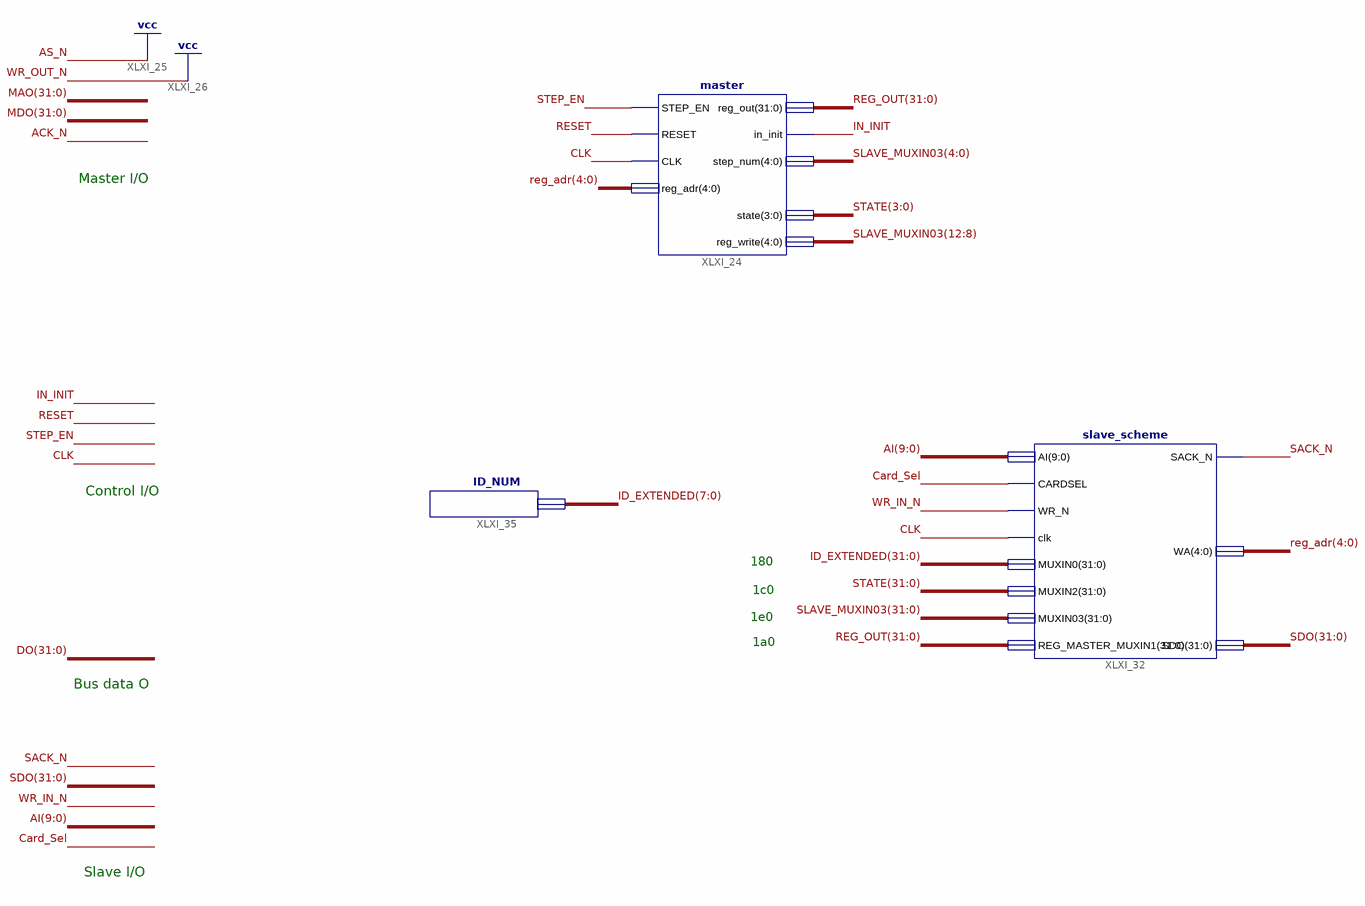
[diagram p0: schematic sheet 1]
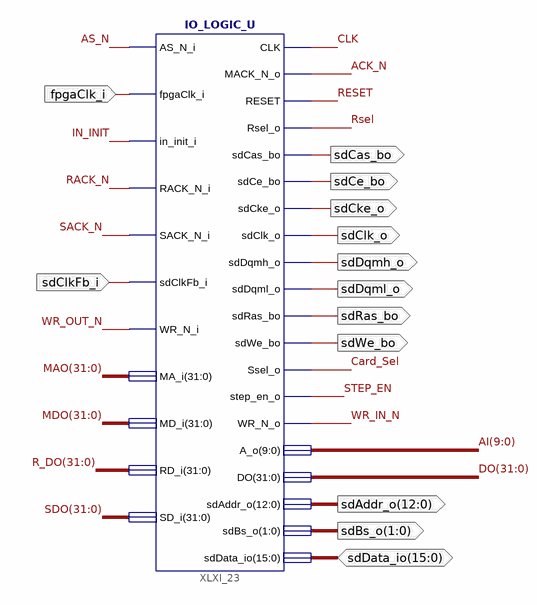
[diagram p1: schematic sheet 2]
// Xilinx ISE schematic Top_Level.sch (spartan6) as structural Verilog: 4 symbols, 13 ports
module Top_Level (
  input  fpgaClk_i,
  input  sdClkFb_i,
  inout  [15:0] sdData_io,
  output sdClk_o,
  output [1:0] sdBs_o,
  output sdDqml_o,
  output sdDqmh_o,
  output sdWe_bo,
  output sdCas_bo,
  output sdRas_bo,
  output sdCe_bo,
  output sdCke_o,
  output [12:0] sdAddr_o
);

  wire ACK_N, Card_Sel, CLK, IN_INIT, RACK_N, RESET, Rsel, SACK_N, STEP_EN, WR_IN_N;
  wire [4:0] reg_adr;
  wire [9:0] AI;
  wire [31:0] DO, ID_EXTENDED, MAO, MDO, R_DO, REG_OUT, SDO, SLAVE_MUXIN03, STATE;

  IO_LOGIC_U XLXI_23 (
    .AS_N_i(1'b1), .fpgaClk_i(fpgaClk_i), .in_init_i(IN_INIT), .RACK_N_i(RACK_N), .SACK_N_i(SACK_N),
    .sdClkFb_i(sdClkFb_i), .WR_N_i(1'b1), .MA_i(MAO), .MD_i(MDO), .RD_i(R_DO), .SD_i(SDO), .CLK(CLK),
    .MACK_N_o(ACK_N), .RESET(RESET), .Rsel_o(Rsel), .sdCas_bo(sdCas_bo), .sdCe_bo(sdCe_bo),
    .sdCke_o(sdCke_o), .sdClk_o(sdClk_o), .sdDqmh_o(sdDqmh_o), .sdDqml_o(sdDqml_o), .sdRas_bo(sdRas_bo),
    .sdWe_bo(sdWe_bo), .Ssel_o(Card_Sel), .step_en_o(STEP_EN), .WR_N_o(WR_IN_N), .A_o(AI), .DO(DO),
    .sdAddr_o(sdAddr_o), .sdBs_o(sdBs_o), .sdData_io(sdData_io));
  master XLXI_24 (
    .STEP_EN(STEP_EN), .RESET(RESET), .CLK(CLK), .reg_adr(reg_adr), .reg_out(REG_OUT), .in_init(IN_INIT),
    .step_num(SLAVE_MUXIN03[4:0]), .state(STATE[3:0]), .reg_write(SLAVE_MUXIN03[12:8]));
  slave_scheme XLXI_32 (
    .AI(AI), .CARDSEL(Card_Sel), .WR_N(WR_IN_N), .clk(CLK), .MUXIN0(ID_EXTENDED), .MUXIN2(STATE),
    .MUXIN03(SLAVE_MUXIN03), .REG_MASTER_MUXIN1(REG_OUT), .SACK_N(SACK_N), .WA(reg_adr), .SDO(SDO));
  ID_NUM XLXI_35 (.ID(ID_EXTENDED[7:0]));

  // Notes on the sheet:
  //   Master I/O
  //   Control I/O
  //   180
  //   1c0
  //   1e0
  //   1a0
  //   Bus data O
  //   Slave I/O
endmodule
